# EAGLE design servo_board (EAGLE 6.5.0)

## Sheet 1 of 2
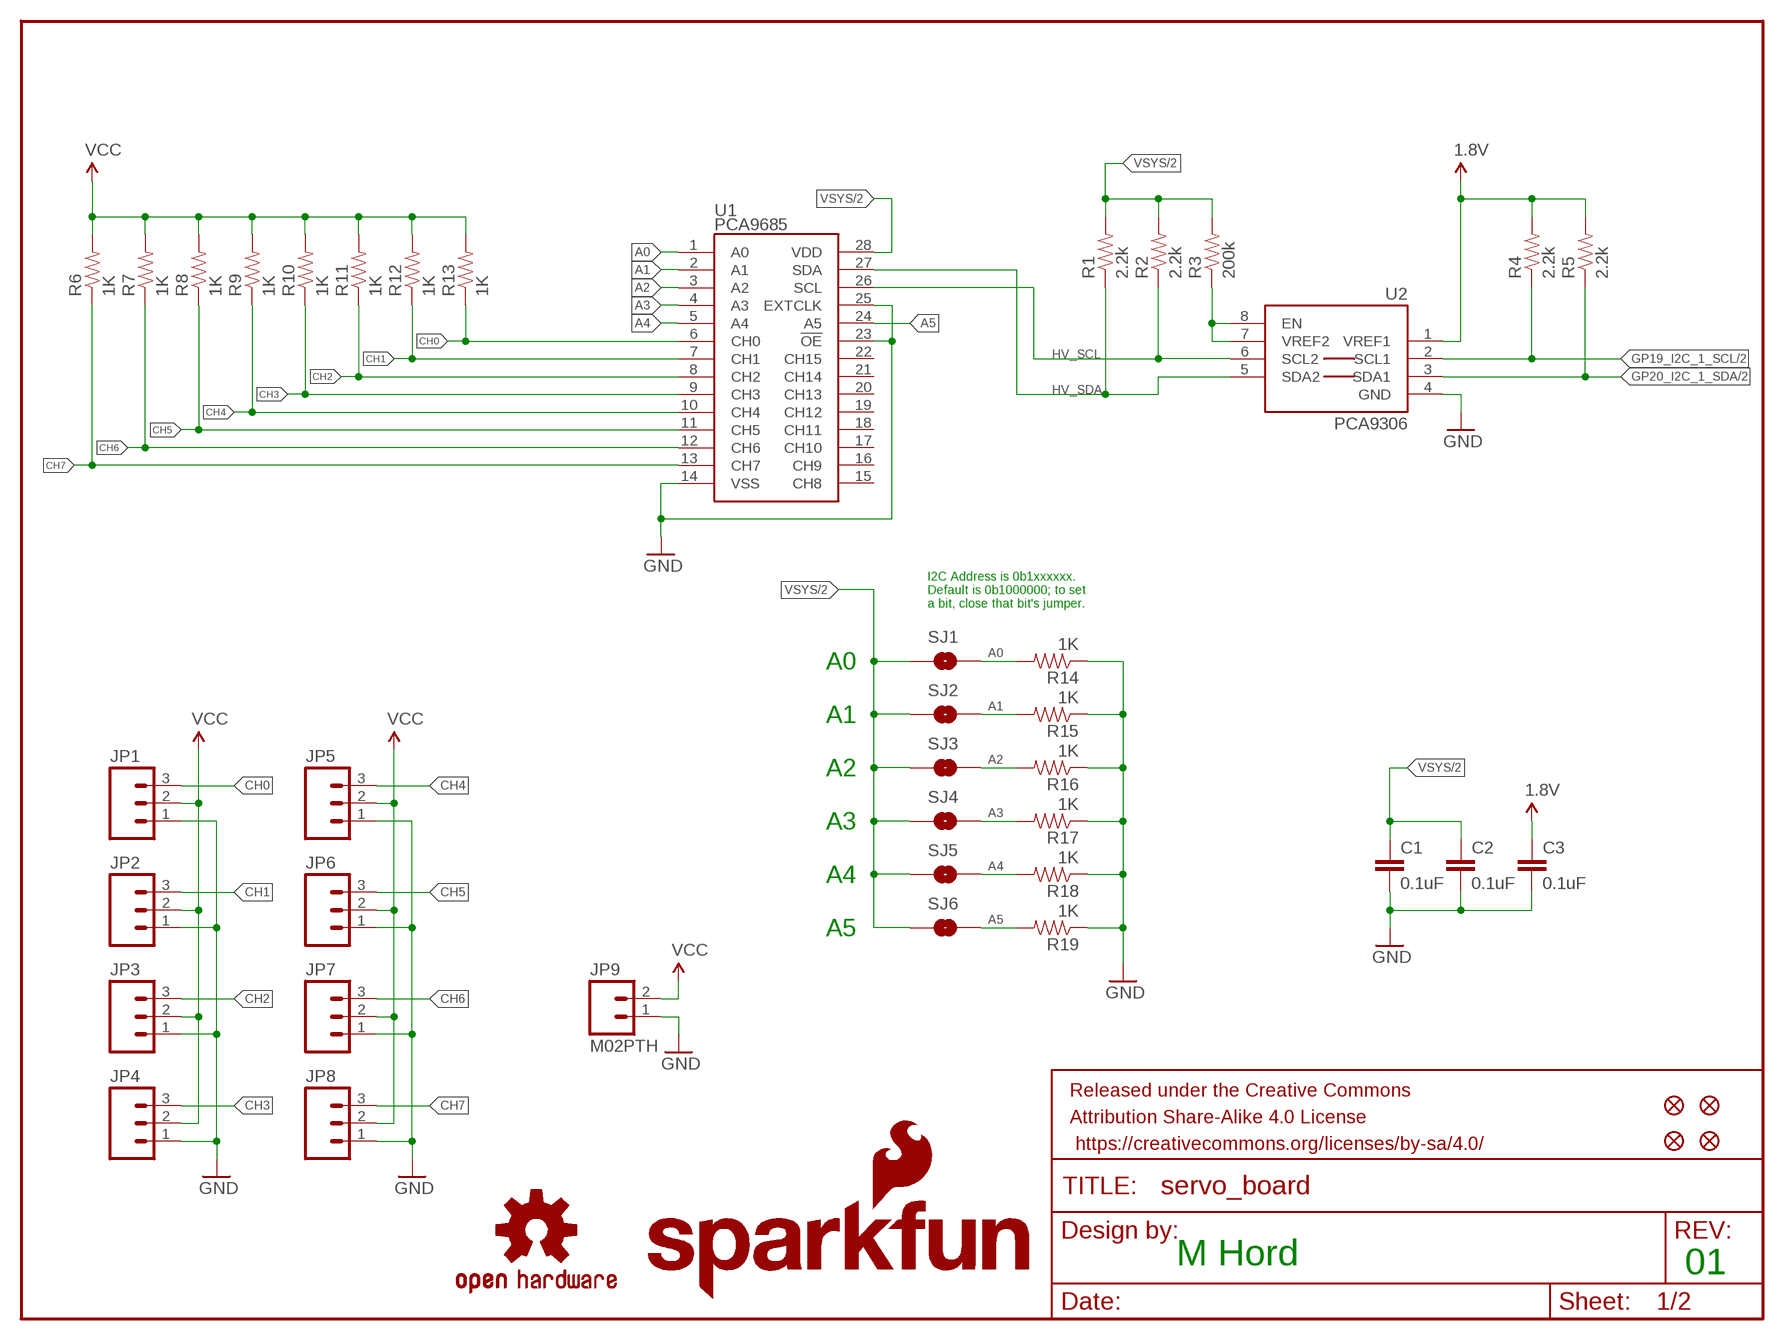
[diagram p0: schematic, sheet 1]

### Parts
C1  0.1uF  0.1UF-25V(+80/-20%)(0603)  [0603-CAP]
C2  0.1uF  0.1UF-25V(+80/-20%)(0603)  [0603-CAP]
C3  0.1uF  0.1UF-25V(+80/-20%)(0603)  [0603-CAP]
FID1  FIDUCIAL1X2  [FIDUCIAL-1X2]
FID2  FIDUCIAL1X2  [FIDUCIAL-1X2]
FID3  FIDUCIAL1X2  [FIDUCIAL-1X2]
FID4  FIDUCIAL1X2  [FIDUCIAL-1X2]
FRAME1  FRAME-LETTER  [CREATIVE_COMMONS]
JP1  M03PTH  [1X03]
JP2  M03PTH  [1X03]
JP3  M03PTH  [1X03]
JP4  M03PTH  [1X03]
JP5  M03PTH  [1X03]
JP6  M03PTH  [1X03]
JP7  M03PTH  [1X03]
JP8  M03PTH  [1X03]
JP9  M02PTH  [1X02]
LOGO1  SFE_LOGO_NAME_FLAME.1_INCH  [SFE_LOGO_NAME_FLAME_.1]
LOGO2  OSHW-LOGOS  [OSHW-LOGO-S]
LOGO3  SFE_LOGO_NAME_FLAME.1_INCH  [SFE_LOGO_NAME_FLAME_.1]
LOGO4  OSHW-LOGOS  [OSHW-LOGO-S]
R1  2.2k  2.2KOHM1/10W1%(0603)  [0603-RES]
R2  2.2k  2.2KOHM1/10W1%(0603)  [0603-RES]
R3  200k  200KOHM1/10W1%(0603)200K  [0603-RES]
R4  2.2k  2.2KOHM1/10W1%(0603)  [0603-RES]
R5  2.2k  2.2KOHM1/10W1%(0603)  [0603-RES]
R6  1K  1KOHM1/10W1%(0603)  [0603-RES]
R7  1K  1KOHM1/10W1%(0603)  [0603-RES]
R8  1K  1KOHM1/10W1%(0603)  [0603-RES]
R9  1K  1KOHM1/10W1%(0603)  [0603-RES]
R10  1K  1KOHM1/10W1%(0603)  [0603-RES]
R11  1K  1KOHM1/10W1%(0603)  [0603-RES]
R12  1K  1KOHM1/10W1%(0603)  [0603-RES]
R13  1K  1KOHM1/10W1%(0603)  [0603-RES]
R14  1K  1KOHM1/10W1%(0603)  [0603-RES]
R15  1K  1KOHM1/10W1%(0603)  [0603-RES]
R16  1K  1KOHM1/10W1%(0603)  [0603-RES]
R17  1K  1KOHM1/10W1%(0603)  [0603-RES]
R18  1K  1KOHM1/10W1%(0603)  [0603-RES]
R19  1K  1KOHM1/10W1%(0603)  [0603-RES]
SJ1  JUMPER-PAD-2-NOYES_SILK  [PAD-JUMPER-2-NO_YES_SILK]
SJ2  JUMPER-PAD-2-NOYES_SILK  [PAD-JUMPER-2-NO_YES_SILK]
SJ3  JUMPER-PAD-2-NOYES_SILK  [PAD-JUMPER-2-NO_YES_SILK]
SJ4  JUMPER-PAD-2-NOYES_SILK  [PAD-JUMPER-2-NO_YES_SILK]
SJ5  JUMPER-PAD-2-NOYES_SILK  [PAD-JUMPER-2-NO_YES_SILK]
SJ6  JUMPER-PAD-2-NOYES_SILK  [PAD-JUMPER-2-NO_YES_SILK]
U1  PCA9685  [TSSOP-28_4MM]
U2  PCA9306  PCA9306PCA9306DC-1:1  [PCA9306DC-1:1]

### Nets
1.8V: C3.1 R4.2 R5.2 U2.1(VREF1) ; also sheet 2
A0: R14.2 SJ1.2 U1.1(A0)
A1: R15.2 SJ2.2 U1.2(A1)
A2: R16.2 SJ3.2 U1.3(A2)
A3: R17.2 SJ4.2 U1.4(A3)
A4: R18.2 SJ5.2 U1.5(A4)
A5: R19.2 SJ6.2 U1.24(A5)
CH0: JP1.3 R13.1 U1.6(CH0)
CH1: JP2.3 R12.1 U1.7(CH1)
CH2: JP3.3 R11.1 U1.8(CH2)
CH3: JP4.3 R10.1 U1.9(CH3)
CH4: JP5.3 R9.1 U1.10(CH4)
CH5: JP6.3 R8.1 U1.11(CH5)
CH6: JP7.3 R7.1 U1.12(CH6)
CH7: JP8.3 R6.1 U1.13(CH7)
GND: C1.2 C2.2 C3.2 JP1.1 JP2.1 JP3.1 JP4.1 JP5.1 JP6.1 JP7.1 JP8.1 JP9.1 R14.1 R15.1 R16.1 R17.1 R18.1 R19.1 U1.14(VSS) U1.23(!OE) U1.25(EXTCLK) U2.4(GND) ; also sheet 2
GP19_I2C_1_SCL: R4.1 U2.2(SCL1) ; also sheet 2
GP20_I2C_1_SDA: R5.1 U2.3(SDA1) ; also sheet 2
HV_SCL: R2.1 U1.26(SCL) U2.6(SCL2)
HV_SDA: R1.1 U1.27(SDA) U2.5(SDA2)
N$1: R3.1 U2.7(VREF2) U2.8(EN)
VCC: JP1.2 JP2.2 JP3.2 JP4.2 JP5.2 JP6.2 JP7.2 JP8.2 JP9.2 R6.2 R7.2 R8.2 R9.2 R10.2 R11.2 R12.2 R13.2
VSYS: C1.1 C2.1 R1.2 R2.2 R3.2 SJ1.1 SJ2.1 SJ3.1 SJ4.1 SJ5.1 SJ6.1 U1.28(VDD) ; also sheet 2
Unconnected: U1.15(CH8) U1.16(CH9) U1.17(CH10) U1.18(CH11) U1.19(CH12) U1.20(CH13) U1.21(CH14) U1.22(CH15)

### Notes on the sheet
- I2C Address is 0b1xxxxxx.
  Default is 0b1000000; to set
  a bit, close that bit's jumper.
- A0
- A1
- A2
- A3
- A4
- A5
- M Hord | 01

## Sheet 2 of 2
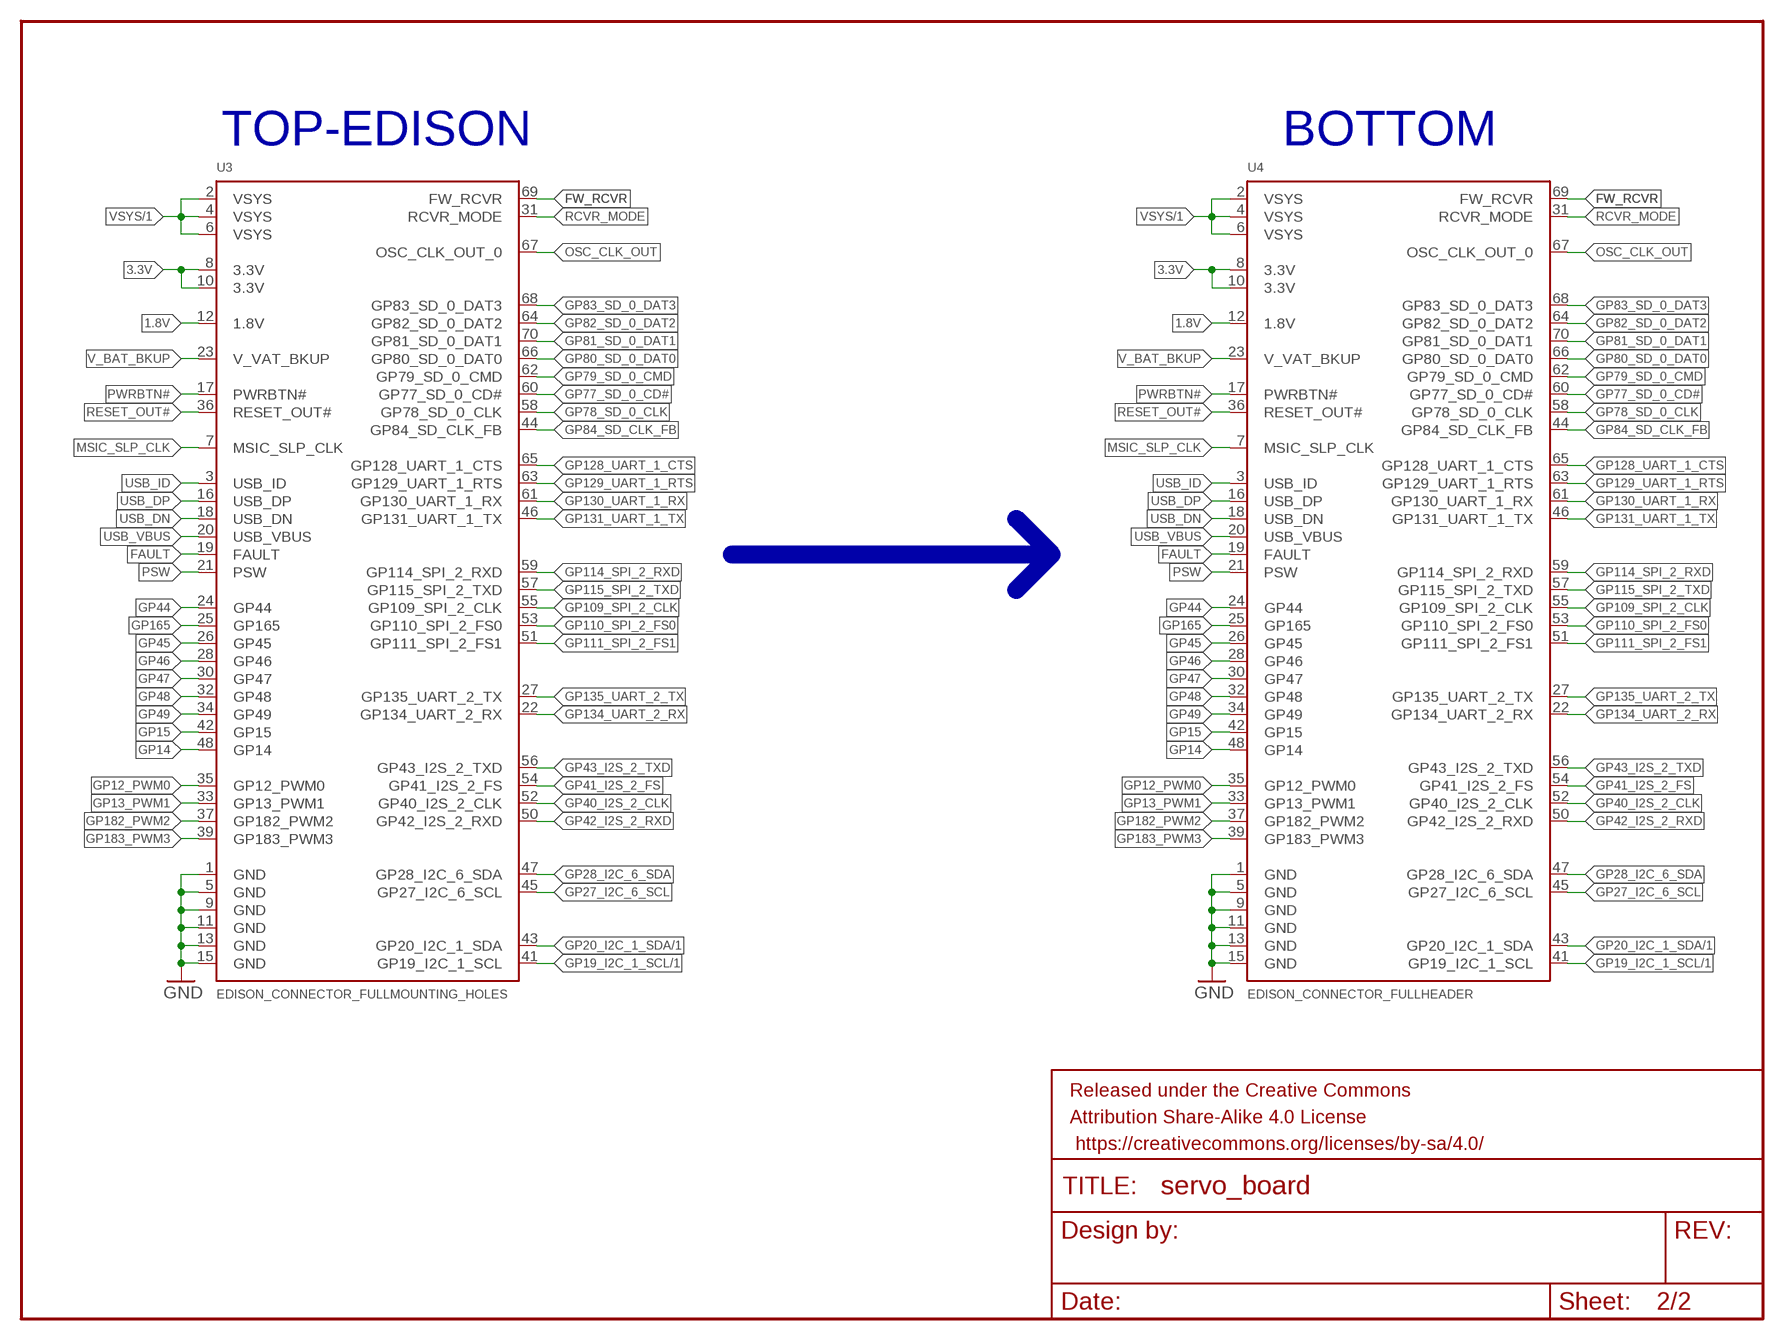
[diagram p1: schematic, sheet 2]

### Parts
FRAME2  FRAME-LETTER  [CREATIVE_COMMONS]
U3  EDISON_CONNECTOR_FULLMOUNTING_HOLES  [EDISON_DAUGHTER]
U4  EDISON_CONNECTOR_FULLHEADER  [DF40C-70DP-0.4(51)]

### Nets
1.8V: U3.12(1.8V) U4.12(1.8V) ; also sheet 1
3.3V: U3.8(3.3V) U3.10(3.3V) U4.8(3.3V) U4.10(3.3V)
FAULT: U3.19(FAULT) U4.19(FAULT)
FW_RCVR: U3.69(FW_RCVR) U4.69(FW_RCVR)
GND: U3.1(GND) U3.5(GND) U3.9(GND) U3.11(GND) U3.13(GND) U3.15(GND) U4.1(GND) U4.5(GND) U4.9(GND) U4.11(GND) U4.13(GND) U4.15(GND) ; also sheet 1
GP12_PWM0: U3.35(GP12_PWM0) U4.35(GP12_PWM0)
GP13_PWM1: U3.33(GP13_PWM1) U4.33(GP13_PWM1)
GP14: U3.48(GP14) U4.48(GP14)
GP15: U3.42(GP15) U4.42(GP15)
GP19_I2C_1_SCL: U3.41(GP19_I2C_1_SCL) U4.41(GP19_I2C_1_SCL) ; also sheet 1
GP20_I2C_1_SDA: U3.43(GP20_I2C_1_SDA) U4.43(GP20_I2C_1_SDA) ; also sheet 1
GP27_I2C_6_SCL: U3.45(GP27_I2C_6_SCL) U4.45(GP27_I2C_6_SCL)
GP28_I2C_6_SDA: U3.47(GP28_I2C_6_SDA) U4.47(GP28_I2C_6_SDA)
GP40_I2S_2_CLK: U3.52(GP40_I2S_2_CLK) U4.52(GP40_I2S_2_CLK)
GP41_I2S_2_FS: U3.54(GP41_I2S_2_FS) U4.54(GP41_I2S_2_FS)
GP42_I2S_2_RXD: U3.50(GP42_I2S_2_RXD) U4.50(GP42_I2S_2_RXD)
GP43_I2S_2_TXD: U3.56(GP43_I2S_2_TXD) U4.56(GP43_I2S_2_TXD)
GP44: U3.24(GP44) U4.24(GP44)
GP45: U3.26(GP45) U4.26(GP45)
GP46: U3.28(GP46) U4.28(GP46)
GP47: U3.30(GP47) U4.30(GP47)
GP48: U3.32(GP48) U4.32(GP48)
GP49: U3.34(GP49) U4.34(GP49)
GP77_SD_0_CD#: U3.60(GP77_SD_0_CD#) U4.60(GP77_SD_0_CD#)
GP78_SD_0_CLK: U3.58(GP78_SD_0_CLK) U4.58(GP78_SD_0_CLK)
GP79_SD_0_CMD: U3.62(GP79_SD_0_CMD) U4.62(GP79_SD_0_CMD)
GP80_SD_0_DAT0: U3.66(GP80_SD_0_DAT0) U4.66(GP80_SD_0_DAT0)
GP81_SD_0_DAT1: U3.70(GP81_SD_0_DAT1) U4.70(GP81_SD_0_DAT1)
GP82_SD_0_DAT2: U3.64(GP82_SD_0_DAT2) U4.64(GP82_SD_0_DAT2)
GP83_SD_0_DAT3: U3.68(GP83_SD_0_DAT3) U4.68(GP83_SD_0_DAT3)
GP84_SD_CLK_FB: U3.44(GP84_SD_CLK_FB) U4.44(GP84_SD_CLK_FB)
GP109_SPI_2_CLK: U3.55(GP109_SPI_2_CLK) U4.55(GP109_SPI_2_CLK)
GP110_SPI_2_FS0: U3.53(GP110_SPI_2_FS0) U4.53(GP110_SPI_2_FS0)
GP111_SPI_2_FS1: U3.51(GP111_SPI_2_FS1) U4.51(GP111_SPI_2_FS1)
GP114_SPI_2_RXD: U3.59(GP114_SPI_2_RXD) U4.59(GP114_SPI_2_RXD)
GP115_SPI_2_TXD: U3.57(GP115_SPI_2_TXD) U4.57(GP115_SPI_2_TXD)
GP128_UART_1_CTS: U3.65(GP128_UART_1_CTS) U4.65(GP128_UART_1_CTS)
GP129_UART_1_RTS: U3.63(GP129_UART_1_RTS) U4.63(GP129_UART_1_RTS)
GP130_UART_1_RX: U3.61(GP130_UART_1_RX) U4.61(GP130_UART_1_RX)
GP131_UART_1_TX: U3.46(GP131_UART_1_TX) U4.46(GP131_UART_1_TX)
GP134_UART_2_RX: U3.22(GP134_UART_2_RX) U4.22(GP134_UART_2_RX)
GP135_UART_2_TX: U3.27(GP135_UART_2_TX) U4.27(GP135_UART_2_TX)
GP165: U3.25(GP165) U4.25(GP165)
GP182_PWM2: U3.37(GP182_PWM2) U4.37(GP182_PWM2)
GP183_PWM3: U3.39(GP183_PWM3) U4.39(GP183_PWM3)
MSIC_SLP_CLK: U3.7(MSIC_SLP_CLK) U4.7(MSIC_SLP_CLK)
OSC_CLK_OUT: U3.67(OSC_CLK_OUT_0) U4.67(OSC_CLK_OUT_0)
PSW: U3.21(PSW) U4.21(PSW)
PWRBTN#: U3.17(PWRBTN#) U4.17(PWRBTN#)
RCVR_MODE: U3.31(RCVR_MODE) U4.31(RCVR_MODE)
RESET_OUT#: U3.36(RESET_OUT#) U4.36(RESET_OUT#)
USB_DN: U3.18(USB_DN) U4.18(USB_DN)
USB_DP: U3.16(USB_DP) U4.16(USB_DP)
USB_ID: U3.3(USB_ID) U4.3(USB_ID)
USB_VBUS: U3.20(USB_VBUS) U4.20(USB_VBUS)
V_BAT_BKUP: U3.23(V_VAT_BKUP) U4.23(V_VAT_BKUP)
VSYS: U3.2(VSYS) U3.4(VSYS) U3.6(VSYS) U4.2(VSYS) U4.4(VSYS) U4.6(VSYS) ; also sheet 1

### Buses
B$1

### Notes on the sheet
- TOP-EDISON | BOTTOM

## Library data of the parts
C1-C3 = SparkFun-Capacitors:0.1UF-25V(+80/-20%)(0603): CAP-00810 Ceramic Standard decoupling cap; PROD_ID: CAP-00810
FID1-FID4 = SparkFun-Aesthetics:FIDUCIAL: Fiducial Alignment Points Various fiducial points for machine vision alignment.
FRAME1 FRAME2 = SparkFun-Aesthetics:FRAME-LETTER: Schematic Frame Standard 8.5x11 US Letter frame
JP1-JP8 = SparkFun-Connectors:M03: Header 3 Standard 3-pin 0.1" header. Use with straight break away headers (SKU : PRT-00116), right angle break away headers (PRT-00553), swiss pins (PRT-00743), machine pins (PRT-00117), and female headers (PRT-00115). Molex polarized connector foot print use with SKU : PRT-08232 with associated crimp pins and housings.
JP9 = SparkFun-Connectors:M02: Standard 2-pin 0.1" header. Use with - straight break away headers ( PRT-00116) - right angle break away headers (PRT-00553) - swiss pins (PRT-00743) - machine pins (PRT-00117) - female headers (PRT-00115) Molex polarized connector foot print use with: PRT-08233 with associated crimp pins and housings. 2.54_SCREWTERM for use with PRT-10571. 3.5mm Screw Terminal footprints for PRT-08084 5mm Screw Terminal footprints for use with PRT-08432
LOGO1 LOGO3 = SparkFun-Aesthetics:SFE_LOGO_NAME_FLAME: SFE Logo, name and flame This is the SparkFun full logo. The logo on the schematic will always be the same size; the package variant is the height of the flame part of the logo. Default layer for the logo on the board is tSilk.
LOGO2 LOGO4 = SparkFun-Aesthetics:OSHW-LOGO: Open Source Hardware Logo This logo indicates the piece of hardware it is found on incorporates a OSHW license and/or adheres to the definition of open source hardware found here: http://freedomdefined.org/OSHW
R1 R2 R4 R5 = SparkFun-Resistors:2.2KOHM1/10W1%(0603): RES-08272; PROD_ID: RES-08272
R3 = SparkFun-Resistors:200KOHM1/10W1%(0603): RES-09385; PROD_ID: RES-09385
R6-R19 = SparkFun-Resistors:1KOHM1/10W1%(0603): RES-07856; PROD_ID: RES-07856
SJ1-SJ6 = SparkFun-Passives:JUMPER-PAD-2-NO
U1 = SparkFun-DigitalIC:PCA9685: 16-channel 12-bit PWM I2C interface Internal Oscillator 40Hz to 1kHz Can be totem pole or open collector 2.3V to 5.5V; PROD_ID: IC-12240
U2 = SparkFun-DigitalIC:PCA9306: Bidirectional I2C level shifter. NOT compatible with all available part number pinout schemes- DOUBLE CHECK!!!; PROD_ID: IC-10023
U3 U4 = Edison:EDISON_CONNECTOR_FULL

## Board
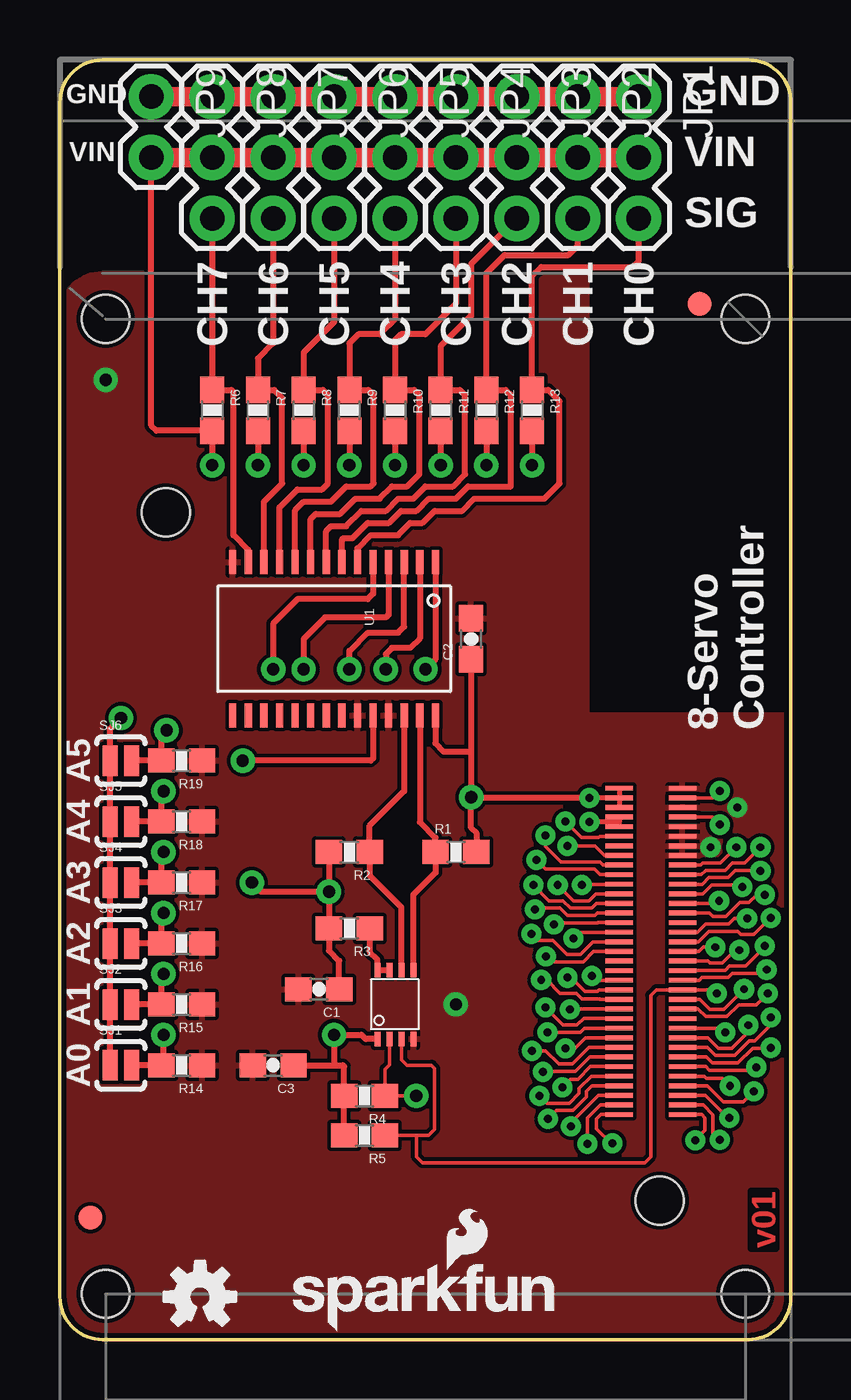
[diagram p2: board, top side]
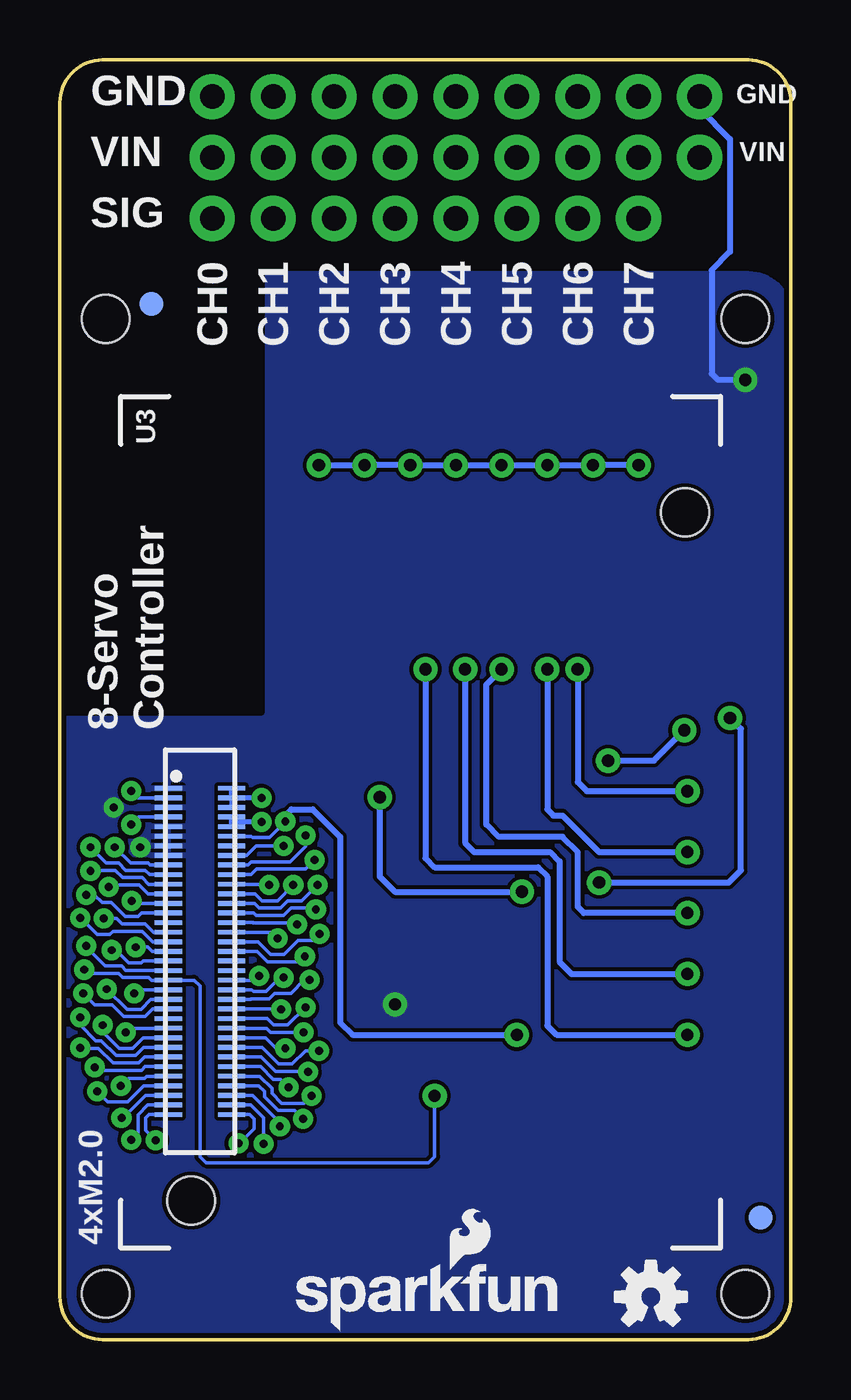
[diagram p3: board, bottom side, seen from below]

Size 30.48 x 53.34 mm. Coordinates in mm from the lower left corner, seen from the top.
Outline: 30.48,51.56 30.48,1.78 arc-90 28.7,0 1.78,0 arc-90 0,1.78 0,51.56 arc-90 1.78,53.34 28.7,53.34 arc-90 30.48,51.56
Copper layers (1*16): Top 0.035mm / dielectric 1.5mm / Bottom 0.035mm
Design rules "SparkFun-2-layer *": minimum track width 6mil, minimum drill 13mil, track to track 6mil, track to pad 6mil, pad to pad 6mil, via to via 6mil, smd to smd 6mil, copper to edge 8mil, drill to drill 8mil, minimum pad ring 12mil, minimum via ring 10mil, stop-mask expansion 4mil, vias tented up to drill 20mil, thermal gap 6mil
Holes 2 mm at 28.57,1.91 1.91,1.91 1.91,42.55 28.57,42.55
tRestrict: area 22.1,26.2 to 30.5,44.5
bRestrict: area 22.1,26.2 to 30.5,44.5

### Footprints (pad centres in the part's own frame; a part is rotated, then mirrored left to right if it is on the bottom)
0603-CAP = smd 1.1 x 1: 1 -0.85,0; 2 0.85,0
FIDUCIAL-1X2 = smd 1 x 1: 1 0,0
1X03 = drill 1.016 pad 1.88: 1 0,0; 2 2.54,0; 3 5.08,0
1X02 = drill 1.016 pad 1.88: 1 0,0; 2 2.54,0
0603-RES = smd 1.1 x 1: 1 -0.85,0; 2 0.85,0
PAD-JUMPER-2-NO_YES_SILK = smd 0.635 x 1.27: 1 -0.45,0; 2 0.45,0
TSSOP-28_4MM = smd 1 x 0.3: 1 -3.2,4.225; 2 -3.2,3.575; 3 -3.2,2.925; 4 -3.2,2.275; 5 -3.2,1.625; 6 -3.2,0.975; 7 -3.2,0.325; 8 -3.2,-0.325; 9 -3.2,-0.975; 10 -3.2,-1.625; 11 -3.2,-2.275; 12 -3.2,-2.925; 13 -3.2,-3.575; 14 -3.2,-4.225; 15 3.2,-4.225; 16 3.2,-3.575; 17 3.2,-2.925; 18 3.2,-2.275; 19 3.2,-1.625; 20 3.2,-0.975; 21 3.2,-0.325; 22 3.2,0.325; 23 3.2,0.975; 24 3.2,1.625; 25 3.2,2.275; 26 3.2,2.925; 27 3.2,3.575; 28 3.2,4.225
PCA9306DC-1:1 = smd 0.25 x 0.602: 1 -0.73,-1.446; 2 -0.23,-1.446; 3 0.27,-1.446; 4 0.77,-1.446; 5 0.77,1.431; 6 0.27,1.431; 7 -0.23,1.431; 8 -0.73,1.431
EDISON_DAUGHTER = smd 1.14 x 0.2: 1 1.98,19.17; 2 4.62,19.17; 3 1.98,18.77; 4 4.62,18.77; 5 1.98,18.37; 6 4.62,18.37; 7 1.98,17.97; 8 4.62,17.97; 9 1.98,17.57; 10 4.62,17.57; 11 1.98,17.17; 12 4.62,17.17; 13 1.98,16.77; 14 4.62,16.77; 15 1.98,16.37; 16 4.62,16.37; 17 1.98,15.97; 18 4.62,15.97; 19 1.98,15.57; 20 4.62,15.57; 21 1.98,15.17; 22 4.62,15.17; 23 1.98,14.77; 24 4.62,14.77; 25 1.98,14.37; 26 4.62,14.37; 27 1.98,13.97; 28 4.62,13.97; 29 1.98,13.57; 30 4.62,13.57; 31 1.98,13.17; 32 4.62,13.17; 33 1.98,12.77; 34 4.62,12.77; 35 1.98,12.37; 36 4.62,12.37; 37 1.98,11.97; 38 4.62,11.97; 39 1.98,11.57; 40 4.62,11.57; 41 1.98,11.17; 42 4.62,11.17; 43 1.98,10.77; 44 4.62,10.77; 45 1.98,10.37; 46 4.62,10.37; 47 1.98,9.97; 48 4.62,9.97; 49 1.98,9.57; 50 4.62,9.57; 51 1.98,9.17; 52 4.62,9.17; 53 1.98,8.77; 54 4.62,8.77; 55 1.98,8.37; 56 4.62,8.37; 57 1.98,7.97; 58 4.62,7.97; 59 1.98,7.57; 60 4.62,7.57; 61 1.98,7.17; 62 4.62,7.17; 63 1.98,6.77; 64 4.62,6.77; 65 1.98,6.37; 66 4.62,6.37; 67 1.98,5.97; 68 4.62,5.97; 69 1.98,5.57; 70 4.62,5.57 | hole 2: 23.53,30.67; 2.93,1.98
DF40C-70DP-0.4(51) = smd 0.2 x 1.14 bottom: 1 6.8,1.32; 2 6.8,-1.32; 3 6.4,1.32; 4 6.4,-1.32; 5 6,1.32; 6 6,-1.32; 7 5.6,1.32; 8 5.6,-1.32; 9 5.2,1.32; 10 5.2,-1.32; 11 4.8,1.32; 12 4.8,-1.32; 13 4.4,1.32; 14 4.4,-1.32; 15 4,1.32; 16 4,-1.32; 17 3.6,1.32; 18 3.6,-1.32; 19 3.2,1.32; 20 3.2,-1.32; 21 2.8,1.32; 22 2.8,-1.32; 23 2.4,1.32; 24 2.4,-1.32; 25 2,1.32; 26 2,-1.32; 27 1.6,1.32; 28 1.6,-1.32; 29 1.2,1.32; 30 1.2,-1.32; 31 0.8,1.32; 32 0.8,-1.32; 33 0.4,1.32; 34 0.4,-1.32; 35 0,1.32; 36 0,-1.32; 37 -0.4,1.32; 38 -0.4,-1.32; 39 -0.8,1.32; 40 -0.8,-1.32; 41 -1.2,1.32; 42 -1.2,-1.32; 43 -1.6,1.32; 44 -1.6,-1.32; 45 -2,1.32; 46 -2,-1.32; 47 -2.4,1.32; 48 -2.4,-1.32; 49 -2.8,1.32; 50 -2.8,-1.32; 51 -3.2,1.32; 52 -3.2,-1.32; 53 -3.6,1.32; 54 -3.6,-1.32; 55 -4,1.32; 56 -4,-1.32; 57 -4.4,1.32; 58 -4.4,-1.32; 59 -4.8,1.32; 60 -4.8,-1.32; 61 -5.2,1.32; 62 -5.2,-1.32; 63 -5.6,1.32; 64 -5.6,-1.32; 65 -6,1.32; 66 -6,-1.32; 67 -6.4,1.32; 68 -6.4,-1.32; 69 -6.8,1.32; 70 -6.8,-1.32

### Placement (x,y rotation side)
C1  10.79,14.61 180 top
C2  17.14,29.21 90 top
C3  8.89,11.43 180 top
FID1  1.27,5.08 0 top
FID2  26.67,43.18 0 top
FID3  1.27,5.08 0 bottom
FID4  26.67,43.18 0 bottom
FRAME1  -1.27,-13.97 0 top  (outside the outline)
FRAME2  -1.27,-13.97 0 top  (outside the outline)
JP1  24.13,51.82 270 top
JP2  21.59,51.82 270 top
JP3  19.05,51.82 270 top
JP4  16.51,51.82 270 top
JP5  13.97,51.82 270 top
JP6  11.43,51.82 270 top
JP7  8.89,51.82 270 top
JP8  6.35,51.82 270 top
JP9  3.81,51.82 270 top
LOGO1  9.27,0.25 0 top
LOGO2  5.84,1.78 0 bottom
LOGO3  21.08,0.25 0 bottom
LOGO4  5.84,1.78 0 top
R1  16.51,20.32 0 top
R2  12.06,20.32 180 top
R3  12.06,17.14 180 top
R4  12.7,10.16 180 top
R5  12.7,8.51 180 top
R6  6.35,38.73 270 top
R7  8.26,38.73 270 top
R8  10.16,38.73 270 top
R9  12.06,38.73 270 top
R10  13.97,38.73 270 top
R11  15.88,38.73 270 top
R12  17.78,38.73 270 top
R13  19.68,38.73 270 top
R14  5.08,11.43 180 top
R15  5.08,13.97 180 top
R16  5.08,16.51 180 top
R17  5.08,19.05 180 top
R18  5.08,21.59 180 top
R19  5.08,24.13 180 top
SJ1  2.54,11.43 0 top
SJ2  2.54,13.97 0 top
SJ3  2.54,16.51 0 top
SJ4  2.54,19.05 0 top
SJ5  2.54,21.59 0 top
SJ6  2.54,24.13 0 top
U1  11.43,29.21 270 top
U2  13.97,13.97 0 top
U3  27.94,3.81 0 bottom
U4  24.64,16.18 90 bottom

### Tracks (layer width: path | path; a pad name or v marks a point on that pad's centre or on a via)
1.8V  (via drill 0.33, 0.51)
  Top 0.152: v21.08,21.59 21.74,20.93 22.45,20.93 22.5,20.98 U4.12
  Top 0.254: R5.2 R4.2 11.85,11.38 11.8,11.43 11.43,11.43 | U2.1 12.75,12.52 12.57,12.7 v11.43,12.7 11.43,11.43 | C3.1 11.43,11.43
  Bottom 0.152: v21.08,21.59 21.74,20.93 22.45,20.93 22.5,20.98 U4.12
  Bottom 0.254: v21.08,21.59 21.08,21.84 20.83,22.1 19.94,22.1 18.8,20.95 18.8,13.21 18.29,12.7 v11.43,12.7
3.3V  (via drill 0.33)
  Top 0.2: v22.08,21.58 23.32,21.58 U4.8 U4.10
  Bottom 0.152: 23.32,21.58 U4.10 | U4.10 | U4.8
  Bottom 0.2: v22.08,21.58 23.32,21.58 | U4.10 U4.8
A0  (via drill 0.51)
  Top 0.254: SJ1.2 R14.2 4.32,11.52 v4.32,12.7 | U1.1 15.65,28.36 v15.24,27.94
  Bottom 0.254: v15.24,27.94 15.24,20.07 14.86,19.68 10.54,19.68 10.16,19.3 10.16,13.08 9.78,12.7 v4.32,12.7
A1  (via drill 0.51)
  Top 0.254: SJ2.2 R15.2 4.23,15.15 v4.32,15.24 | U1.2 15.01,29.23 14.61,28.83 13.84,28.83 13.59,28.57 v13.59,27.94
  Bottom 0.254: v13.59,27.94 13.59,20.7 13.21,20.32 10.03,20.32 9.65,19.94 9.65,15.75 9.14,15.24 v4.32,15.24
A2  (via drill 0.51)
  Top 0.254: SJ3.2 R16.2 4.23,17.69 v4.32,17.78 | v12.06,27.94 12.06,28.7 12.83,29.46 14.1,29.46 14.35,29.72 U1.3
  Bottom 0.254: v4.32,17.78 8.64,17.78 8.89,18.03 8.89,20.32 9.53,20.95 12.19,20.95 12.7,21.46 12.7,27.3 v12.06,27.94
A3  (via drill 0.51)
  Top 0.254: SJ4.2 R17.2 4.23,20.23 v4.32,20.32 | U1.4 13.71,30.21 13.59,30.1 11.05,30.1 10.16,29.21 v10.16,27.94
  Bottom 0.254: v10.16,27.94 10.16,22.1 9.91,21.84 9.53,21.84 8,20.32 v4.32,20.32
A4  (via drill 0.51)
  Top 0.254: SJ5.2 R18.2 4.23,22.77 v4.32,22.86 | U1.5 13.05,31.09 12.83,30.86 9.91,30.86 8.89,29.84 v8.89,27.94
  Bottom 0.254: v8.89,27.94 8.89,23.24 8.51,22.86 v4.32,22.86
A5  (via drill 0.51)
  Top 0.254: SJ6.2 R19.2 4.23,25.18 v4.45,25.4 | U1.24 13.05,24.23 12.95,24.13 v7.62,24.13
  Bottom 0.254: v7.62,24.13 5.71,24.13 v4.45,25.4
CH0
  Top 0.254: JP1.3 24.13,44.96 23.88,44.7 20.07,44.7 19.68,44.32 R13.1 20.36,39.59 20.83,39.12 20.83,35.69 20.19,35.05 17.27,35.05 16.76,34.54 15.62,34.54 15.11,34.04 14.61,34.04 14.1,33.53 12.95,33.53 12.4,32.98 U1.6
CH1
  Top 0.254: JP2.3 21.59,45.59 21.21,45.21 18.54,45.21 17.78,44.45 R12.1 18.58,39.59 18.8,39.37 18.8,35.56 17.02,35.56 16.51,35.05 15.37,35.05 14.86,34.54 14.22,34.54 13.72,34.04 12.83,34.04 12.19,33.4 11.81,33.4 11.76,33.34 U1.7
CH2
  Top 0.254: JP3.3 17.14,44.83 17.14,42.67 15.88,41.4 R11.1 16.68,39.59 16.89,39.37 16.89,36.07 16.38,35.56 15.24,35.56 14.73,35.05 14.1,35.05 13.59,34.54 12.57,34.54 11.94,33.91 11.3,33.91 11.11,33.71 U1.8
CH3
  Top 0.254: JP4.3 16.51,43.18 15.24,41.91 14.22,41.91 13.97,41.66 R10.1 14.77,39.59 14.99,39.37 14.99,36.07 14.48,35.56 13.84,35.56 13.34,35.05 12.32,35.05 11.68,34.42 10.67,34.42 10.46,34.2 U1.9
CH4
  Top 0.254: JP5.3 13.97,42.55 13.34,41.91 12.45,41.91 12.06,41.53 R9.1 12.87,39.59 13.08,39.37 13.08,35.69 12.95,35.56 11.94,35.56 11.3,34.92 10.16,34.92 9.8,34.57 U1.10
CH5
  Top 0.254: JP6.3 11.43,42.42 10.16,41.15 R8.1 10.96,39.59 11.18,39.37 11.18,35.69 10.92,35.43 9.91,35.43 9.15,34.68 U1.11
CH6
  Top 0.254: JP7.3 8.89,41.53 8.26,40.89 R7.1 8.93,39.59 9.27,39.24 9.27,35.69 8.51,34.92 U1.12
CH7
  Top 0.254: JP8.3 R6.1 7.15,39.59 7.24,39.5 7.24,33.53 7.86,32.91 U1.13
FAULT  (via drill 0.33)
  Top 0.152: U4.19 26.75,19.38 26.92,19.56 27.74,19.56 28.04,19.86 28.55,19.86 v29.21,20.52
  Bottom 0.152: v29.21,20.52 28.55,19.86 28.04,19.86 27.74,19.56 26.92,19.56 26.75,19.38 U4.19
FW_RCVR  (via drill 0.33)
  Top 0.152: v26.49,8.31 26.9,8.71 26.9,9.25 26.76,9.38 U4.69
  Bottom 0.152: U4.69 26.76,9.38 26.9,9.25 26.9,8.71 v26.49,8.31
GND  (via drill 0.33, 0.51)
  Top 0.813: JP9.1 JP8.1 JP7.1 JP6.1 JP5.1 JP4.1 JP3.1 JP2.1 JP1.1
  Bottom 0.254: v1.91,40.01 3.05,40.01 3.3,40.26 3.3,44.58 2.54,45.34 2.54,50.04 3.81,51.31 JP9.1
  other vias: 27.13,20.52 28.24,22.17 16.51,13.97
  pour Bottom (isolate 0.152, rank 6): 30.48,42.67 30.48,1.78 arc-90 28.7,0 1.78,0 arc-90 0,1.78 0,42.67 arc-90 1.78,44.45 28.7,44.45 arc-90
  pour Top (rank 6): 30.48,1.73 arc-90 28.75,0 1.78,0 arc-90 0,1.78 0,42.67 arc-90 1.78,44.45 28.7,44.45 arc-90 30.48,42.67
GP12_PWM0  (via drill 0.33)
  Top 0.152: U4.35 26.64,16.18 26.82,16.36 v27.33,16.36
  Bottom 0.152: v27.33,16.36 26.82,16.36 26.64,16.18 U4.35 | U4.35
GP13_PWM1  (via drill 0.33)
  Top 0.152: v29.64,17.58 29.62,17.58 28.93,16.89 28.4,16.89 28.27,17.02 27.05,17.02 26.61,16.58 U4.33
  Bottom 0.152: U4.33 26.61,16.58 27.05,17.02 28.27,17.02 28.4,16.89 28.93,16.89 29.62,17.58 v29.64,17.58
GP14  (via drill 0.33)
  Top 0.152: v21.26,13.77 21.27,13.78 U4.48
  Bottom 0.152: U4.48 21.27,13.78 v21.26,13.77
GP15  (via drill 0.33)
  Top 0.152: U4.42 22.36,14.98 v22.17,15.16
  Bottom 0.152: v22.17,15.16 22.36,14.98 U4.42
GP19_I2C_1_SCL  (via drill 0.33, 0.51)
  Top 0.152: U4.41 26.66,14.98 26.77,15.09 27.86,15.09 28.04,15.27 29.31,15.27 v29.46,15.42 | U2.2 13.74,11.45 13.55,11.26 R4.1 v14.86,10.16
  Bottom 0.152: v29.46,15.42 29.31,15.27 28.04,15.27 27.86,15.09 26.77,15.09 26.66,14.98 U4.41 24.89,14.98 24.64,14.73 24.64,7.62 24.38,7.37 15.11,7.37 14.86,7.62 v14.86,10.16
GP20_I2C_1_SDA  (via drill 0.33)
  Top 0.152: v27.38,14.43 27.23,14.58 U4.43 24.87,14.58 24.64,14.35 24.64,7.62 24.38,7.37 15.11,7.37 14.86,7.62 14.86,8.51 | U2.3 14.24,11.67 14.48,11.43 15.49,11.43 15.62,11.3 15.62,8.76 15.37,8.51 14.86,8.51 | 14.86,8.51 R5.1
  Bottom 0.152: v27.38,14.43 27.23,14.58 U4.43 | U4.43
GP27_I2C_6_SCL  (via drill 0.33)
  Top 0.152: v28.52,14.61 27.69,13.77 27.1,13.77 26.69,14.18 U4.45
  Bottom 0.152: U4.45 26.69,14.18 27.1,13.77 27.69,13.77 v28.52,14.61
GP28_I2C_6_SDA  (via drill 0.33)
  Top 0.152: U4.47 26.61,13.78 26.92,13.46 27.81,13.46 28.3,13.95 29.03,13.95 v29.52,14.43
  Bottom 0.152: v29.52,14.43 29.03,13.95 28.3,13.95 27.81,13.46 26.92,13.46 26.61,13.78 U4.47
GP40_I2S_2_CLK  (via drill 0.33)
  Top 0.152: U4.52 21.87,12.98 21.69,12.8 v20.32,12.8
  Bottom 0.152: v20.32,12.8 21.69,12.8 21.87,12.98 U4.52
GP41_I2S_2_FS  (via drill 0.33)
  Top 0.152: v21.08,12.14 21.46,12.14 21.9,12.58 U4.54
  Bottom 0.152: U4.54 21.9,12.58 21.46,12.14 v21.08,12.14
GP42_I2S_2_RXD  (via drill 0.33)
  Top 0.152: U4.50 21.84,13.38 21.57,13.11 20.98,13.11 v20.24,13.84
  Bottom 0.152: v20.24,13.84 20.98,13.11 21.57,13.11 21.84,13.38 U4.50
GP43_I2S_2_TXD  (via drill 0.33)
  Top 0.152: U4.56 22.06,12.18 21.36,11.48 20.8,11.48 20.24,12.04 v19.68,12.04
  Bottom 0.152: v19.68,12.04 20.24,12.04 20.8,11.48 21.36,11.48 22.06,12.18 U4.56
GP44  (via drill 0.33)
  Top 0.152: U4.24 22.34,18.58 22.05,18.29 21.41,18.29 v20.75,18.95
  Bottom 0.152: v20.75,18.95 21.41,18.29 22.05,18.29 22.34,18.58 U4.24
GP45  (via drill 0.33)
  Top 0.152: v19.74,18.95 20.4,18.29 20.98,18.29 21.29,17.98 22.17,17.98 22.37,18.18 U4.26
  Bottom 0.152: U4.26 22.37,18.18 22.17,17.98 21.29,17.98 20.98,18.29 20.4,18.29 v19.74,18.95
GP46  (via drill 0.33)
  Top 0.152: U4.28 22.4,17.78 22.3,17.68 21.16,17.68 20.85,17.98 19.86,17.98 v19.81,17.93
  Bottom 0.152: v19.81,17.93 19.86,17.98 20.85,17.98 21.16,17.68 22.3,17.68 22.4,17.78 U4.28
GP47  (via drill 0.33)
  Top 0.152: U4.30 22.43,17.38 22.43,17.37 20.68,17.37 v20.6,17.3
  Bottom 0.152: v20.6,17.3 20.68,17.37 22.43,17.37 22.43,17.38 U4.30
GP48  (via drill 0.33)
  Top 0.152: v21.41,16.71 21.68,16.98 U4.32
  Bottom 0.152: U4.32 21.68,16.98 v21.41,16.71
GP49  (via drill 0.33)
  Top 0.152: U4.34 22.22,16.58 21.69,16.05 21.13,16.05 20.55,16.64 19.94,16.64 v19.66,16.92
  Bottom 0.152: v19.66,16.92 19.94,16.64 20.55,16.64 21.13,16.05 21.69,16.05 22.22,16.58 U4.34
GP77_SD_0_CD#  (via drill 0.33)
  Top 0.152: U4.60 22.12,11.38 21.59,10.85 21.29,10.85 v20.95,10.52
  Bottom 0.152: v20.95,10.52 21.29,10.85 21.59,10.85 22.12,11.38 U4.60
GP78_SD_0_CLK  (via drill 0.33)
  Top 0.152: U4.58 22.09,11.78 21.49,11.18 20.17,11.18 v20.14,11.15
  Bottom 0.152: v20.14,11.15 20.17,11.18 21.49,11.18 22.09,11.78 U4.58
GP79_SD_0_CMD  (via drill 0.33)
  Top 0.152: U4.62 22.16,10.98 21.64,10.46 21.64,10.26 21.23,9.86 20.3,9.86 v19.99,10.16
  Bottom 0.152: v19.99,10.16 20.3,9.86 21.23,9.86 21.64,10.26 21.64,10.46 22.16,10.98 U4.62
GP80_SD_0_DAT0  (via drill 0.33)
  Top 0.152: v21.31,8.89 21.31,9.04 22.45,10.18 U4.66
  Bottom 0.152: U4.66 22.45,10.18 21.31,9.04 v21.31,8.89
GP81_SD_0_DAT1  (via drill 0.33)
  Top 0.152: U4.70 22.56,9.38 22.38,9.2 22.38,8.79 22.99,8.18 v23.04,8.18
  Bottom 0.152: v23.04,8.18 22.99,8.18 22.38,8.79 22.38,9.2 22.56,9.38 U4.70
GP82_SD_0_DAT2  (via drill 0.33)
  Top 0.152: U4.64 22.19,10.58 21.95,10.34 21.95,10.11 21.39,9.55 20.7,9.55 v20.34,9.2
  Bottom 0.152: v20.34,9.2 20.7,9.55 21.39,9.55 21.95,10.11 21.95,10.34 22.19,10.58 U4.64
GP83_SD_0_DAT3  (via drill 0.33)
  Top 0.152: v22,8.15 22,9.25 22.53,9.78 U4.68
  Bottom 0.152: U4.68 22.53,9.78 22,9.25 v22,8.15
GP84_SD_CLK_FB  (via drill 0.33)
  Top 0.152: U4.44 22.48,14.58 22.4,14.5 21.89,14.5 21.31,15.09 v21.16,15.09
  Bottom 0.152: v21.16,15.09 21.31,15.09 21.89,14.5 22.4,14.5 22.48,14.58 U4.44 | U4.44
GP109_SPI_2_CLK  (via drill 0.33)
  Top 0.152: U4.55 26.99,12.18 27.33,11.84 28.14,11.84 28.75,12.45 28.98,12.45 29.64,13.11 v29.64,13.44
  Bottom 0.152: v29.64,13.44 29.64,13.11 28.98,12.45 28.75,12.45 28.14,11.84 27.33,11.84 26.99,12.18 U4.55
GP110_SPI_2_FS0  (via drill 0.33)
  Top 0.152: v28.7,13.11 28.7,12.83 28.02,12.14 27.46,12.14 27.02,12.58 U4.53
  Bottom 0.152: U4.53 27.02,12.58 27.46,12.14 28.02,12.14 28.7,12.83 v28.7,13.11
GP111_SPI_2_FS1  (via drill 0.33)
  Top 0.152: v27.74,12.8 27.56,12.98 U4.51
  Bottom 0.152: U4.51 27.56,12.98 v27.74,12.8
GP114_SPI_2_RXD  (via drill 0.33)
  Top 0.152: U4.59 26.92,11.38 27.08,11.23 28.91,11.23 v29.03,11.35
  Bottom 0.152: U4.59 26.92,11.38 27.08,11.23 28.91,11.23 v29.03,11.35
GP115_SPI_2_TXD  (via drill 0.33)
  Top 0.152: U4.57 26.95,11.78 27.2,11.53 28.27,11.53 28.88,12.14 29.62,12.14 v29.64,12.17
  Bottom 0.152: U4.57 26.95,11.78 27.2,11.53 28.27,11.53 28.88,12.14 29.62,12.14 v29.64,12.17
GP128_UART_1_CTS  (via drill 0.33)
  Top 0.152: U4.65 26.9,10.18 27.84,9.25 v27.91,9.25
  Bottom 0.152: v27.91,9.25 27.84,9.25 26.9,10.18 U4.65
GP129_UART_1_RTS  (via drill 0.33)
  Top 0.152: v28.93,10.34 28.5,9.91 27.66,9.91 26.99,10.58 U4.63
  Bottom 0.152: U4.63 26.99,10.58 27.66,9.91 28.5,9.91 v28.93,10.34
GP130_UART_1_RX  (via drill 0.33)
  Top 0.152: v27.94,10.57 27.61,10.9 26.95,10.9 26.87,10.98 U4.61
  Bottom 0.152: U4.61 26.87,10.98 26.95,10.9 27.61,10.9 v27.94,10.57
GP131_UART_1_TX  (via drill 0.33)
  Top 0.152: U4.46 22.52,14.18 22.5,14.2 21.77,14.2 21.54,14.43 20.85,14.43 20.3,14.99 v20.07,14.99
  Bottom 0.152: v20.07,14.99 20.3,14.99 20.85,14.43 21.54,14.43 21.77,14.2 22.5,14.2 22.52,14.18 U4.46
GP134_UART_2_RX  (via drill 0.33)
  Top 0.152: v21.77,18.95 21.8,18.98 U4.22
  Bottom 0.152: U4.22 21.8,18.98 v21.77,18.95
GP135_UART_2_TX  (via drill 0.33)
  Top 0.152: v29.39,18.54 29.06,18.54 28.73,18.21 28.35,18.21 27.76,17.63 27.23,17.63 27.08,17.78 U4.27
  Bottom 0.152: U4.27 27.08,17.78 27.23,17.63 27.76,17.63 28.35,18.21 28.73,18.21 29.06,18.54 v29.39,18.54
GP165  (via drill 0.33)
  Top 0.152: v27.48,18.29 27.38,18.18 U4.25
  Bottom 0.152: U4.25 27.38,18.18 v27.48,18.29
GP182_PWM2  (via drill 0.33)
  Top 0.152: U4.37 27.02,15.78 27.1,15.7 27.61,15.7 28.14,16.23 v28.32,16.23
  Bottom 0.152: v28.32,16.23 28.14,16.23 27.61,15.7 27.1,15.7 27.02,15.78 U4.37
GP183_PWM3  (via drill 0.33)
  Top 0.152: v29.39,16.41 29.39,16.36 28.6,15.57 27.91,15.57 27.74,15.39 26.62,15.39 26.61,15.38 U4.39
  Bottom 0.152: U4.39 26.61,15.38 26.62,15.39 27.74,15.39 27.91,15.57 28.6,15.57 29.39,16.36 v29.39,16.41
HV_SCL
  Top 0.254: U2.6 14.24,18.02 12.91,19.34 R2.1 12.91,21.42 14.36,22.86 U1.26
HV_SDA
  Top 0.254: U1.27 15.01,21.57 15.66,20.92 R1.1 15.66,19.47 14.74,18.55 U2.5
MSIC_SLP_CLK  (via drill 0.33)
  Top 0.152: v27.51,21.46 27.19,21.78 U4.7
  Bottom 0.152: U4.7 27.19,21.78 v27.51,21.46
N$1
  Top 0.254: U2.7 U2.8 13.24,15.84 12.91,16.17 R3.1
OSC_CLK_OUT  (via drill 0.33)
  Top 0.152: v27.51,8.33 27.23,8.61 27.23,9.37 26.82,9.78 U4.67
  Bottom 0.152: U4.67 26.82,9.78 27.23,9.37 27.23,8.61 v27.51,8.33
PSW  (via drill 0.33)
  Top 0.152: v29.21,19.53 29.18,19.56 28.17,19.56 27.86,19.25 27.05,19.25 26.78,18.98 U4.21
  Bottom 0.152: U4.21 26.78,18.98 27.05,19.25 27.86,19.25 28.17,19.56 29.18,19.56 v29.21,19.53
PWRBTN#  (via drill 0.33)
  Top 0.152: v28.19,20.52 27.53,19.86 26.8,19.86 26.71,19.78 U4.17
  Bottom 0.152: U4.17 26.71,19.78 26.8,19.86 27.53,19.86 v28.19,20.52
RCVR_MODE  (via drill 0.33)
  Top 0.152: v28.65,17.55 28.12,17.55 27.89,17.32 26.92,17.32 26.58,16.98 U4.31
  Bottom 0.152: U4.31 26.58,16.98 26.92,17.32 27.89,17.32 28.12,17.55 v28.65,17.55
RESET_OUT#  (via drill 0.33)
  Top 0.152: U4.36 22.25,16.18 21.82,15.75 20.5,15.75 v20.27,15.98
  Bottom 0.152: v20.27,15.98 20.5,15.75 21.82,15.75 22.25,16.18 U4.36
USB_DN  (via drill 0.33)
  Top 0.152: U4.18 22.64,19.78 22.5,19.91 20.88,19.91 20.24,20.55 v20.24,21.01
  Bottom 0.152: v20.24,21.01 20.24,20.55 20.88,19.91 22.5,19.91 22.64,19.78 U4.18
USB_DP  (via drill 0.33)
  Top 0.152: v21.16,20.57 22.3,20.57 22.7,20.18 U4.16
  Bottom 0.152: U4.16 22.7,20.18 22.3,20.57 v21.16,20.57
USB_ID  (via drill 0.33)
  Top 0.152: v27.51,22.86 27.23,22.58 U4.3
  Bottom 0.152: U4.3 27.23,22.58 v27.51,22.86
USB_VBUS  (via drill 0.33)
  Top 0.152: v19.86,19.99 20.24,19.61 22.28,19.61 22.5,19.38 U4.20
  Bottom 0.152: U4.20 22.5,19.38 22.28,19.61 20.24,19.61 v19.86,19.99
V_BAT_BKUP  (via drill 0.33)
  Top 0.152: v28.45,18.87 28.37,18.95 27.18,18.95 26.81,18.58 U4.23
  Bottom 0.152: U4.23 26.81,18.58 27.18,18.95 28.37,18.95 v28.45,18.87
VCC  (via drill 0.51)
  Top 0.254: JP9.2 3.81,38.1 4.03,37.88 R6.2 v6.35,36.45 | R7.2 v8.26,36.45 | R8.2 v10.16,36.45 | R9.2 v12.06,36.45 | R10.2 v13.97,36.45 | R11.2 v15.88,36.45 | R12.2 v17.78,36.45 | R13.2 v19.68,36.45
  Top 0.813: JP9.2 JP8.2 JP7.2 JP6.2 JP5.2 JP4.2 JP3.2 JP2.2 JP1.2
  Bottom 0.254: v19.68,36.45 v17.78,36.45 v15.88,36.45 v13.97,36.45 v12.06,36.45 v10.16,36.45 v8.26,36.45 v6.35,36.45
VSYS  (via drill 0.33, 0.51)
  Top 0.2: U4.4 U4.2 U4.4 | U4.4 U4.6 | U4.4 v22.08,22.58
  Top 0.254: C2.1 17.14,24.51 | 17.14,24.51 v17.14,22.61 17.14,22.48 | v22.08,22.58 17.25,22.58 17.14,22.48 | R1.2 17.36,21.12 17.14,21.34 17.14,22.48 | U1.28 15.65,24.86 16,24.51 17.14,24.51 | R2.2 v11.21,18.67 | v11.21,18.67 R3.2 11.21,16.22 11.64,15.79 C1.1 | SJ1.1 SJ2.1 SJ3.1 SJ4.1 SJ5.1 SJ6.1 | v11.21,18.67 8.38,18.67 v8,19.05 | 2.16,25.53 v2.54,25.91 2.09,25.46 SJ6.1 | 2.16,24.2 SJ6.1
  Bottom 0.2: U4.4 U4.6 | U4.4 U4.2 | v22.08,22.58 U4.4
  Bottom 0.254: v17.14,22.61 17.14,19.3 16.51,18.67 v11.21,18.67 | v8,19.05 2.6,19.05 2.09,19.56 2.09,25.46 v2.54,25.91

### Text on the board
Top: v01
tPlace: GND | GND | VIN | VIN | SIG | CH7 | CH6 | CH5 | CH4 | CH3 | CH2 | CH1 | CH0 | 8-Servo / Controller | A5 | A4 | A3 | A2 | A1 | A0
bPlace: GND | GND | VIN | VIN | SIG | CH7 | CH6 | CH5 | CH4 | CH3 | CH2 | CH1 | CH0 | 8-Servo / Controller | 4xM2.0
tDocu: Max Board Length | Connectors Go Here | LED's and selector switches go here | Nothing goes here... I mean it. | M Hord